# Altium schematic sheet Dent_Sheet_ESP.SchDoc (part 1 of 3)
size A2; SheetNumber: 1; SheetTotal: 1
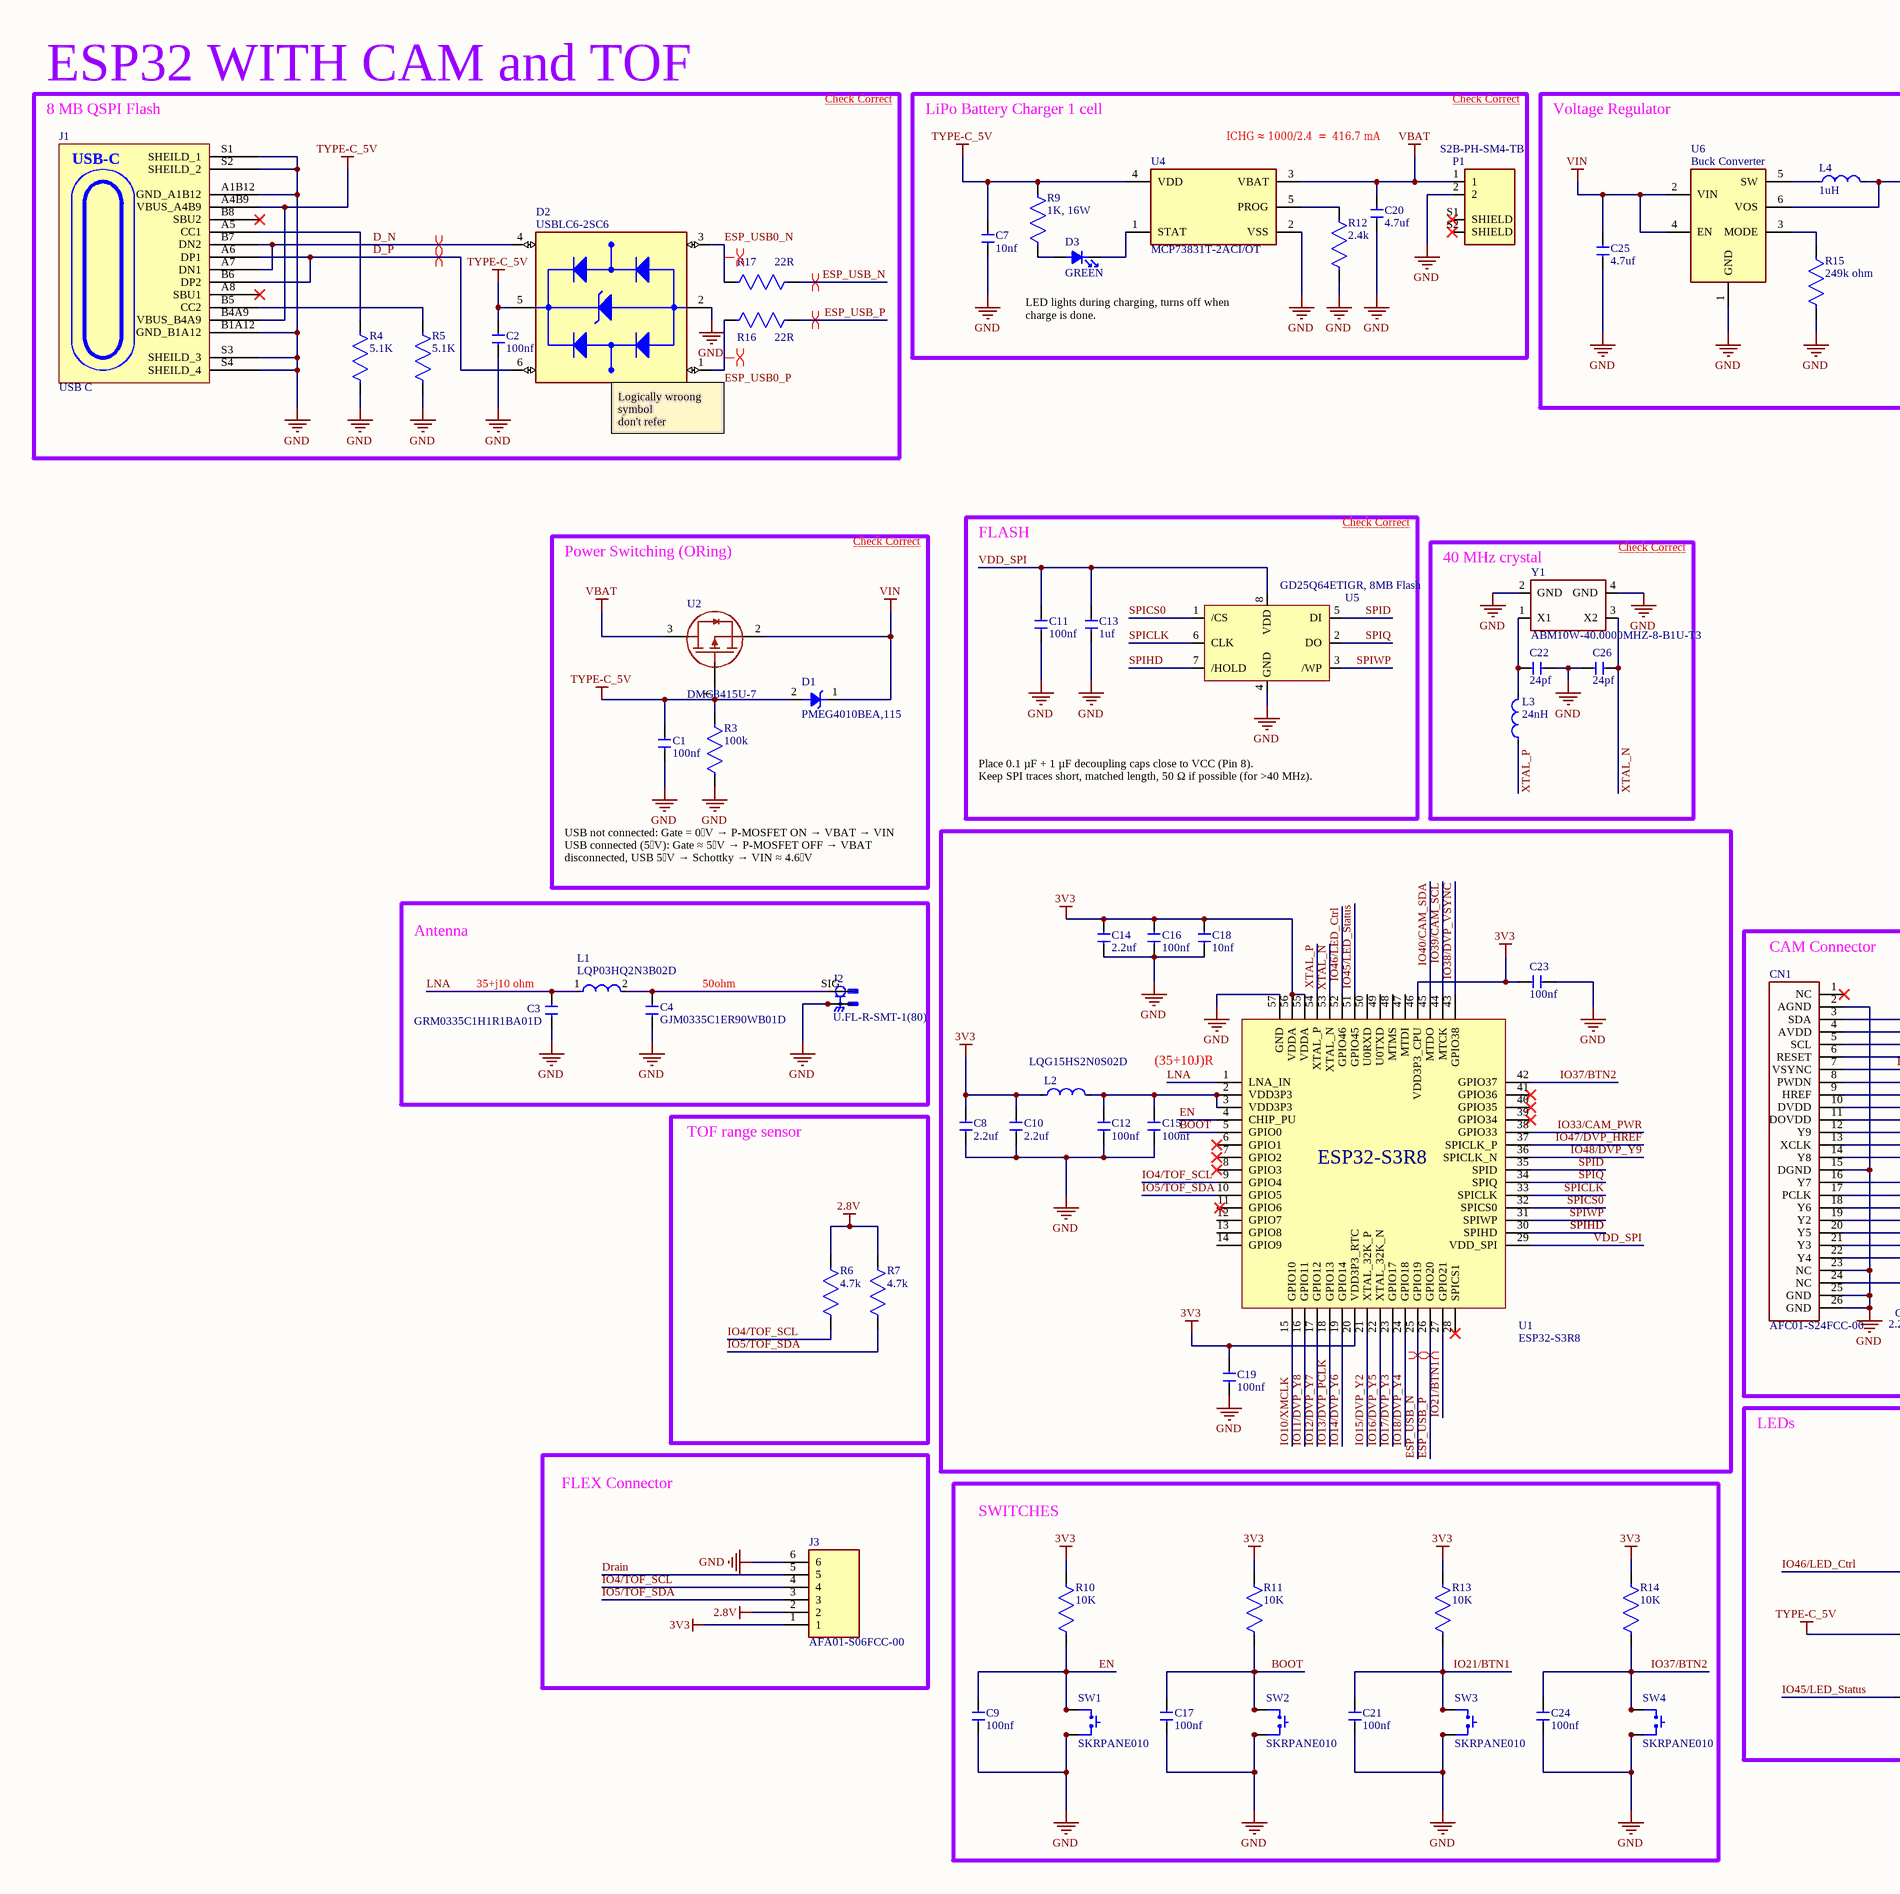
[diagram p0: Dent_Sheet_ESP.SchDoc, left]
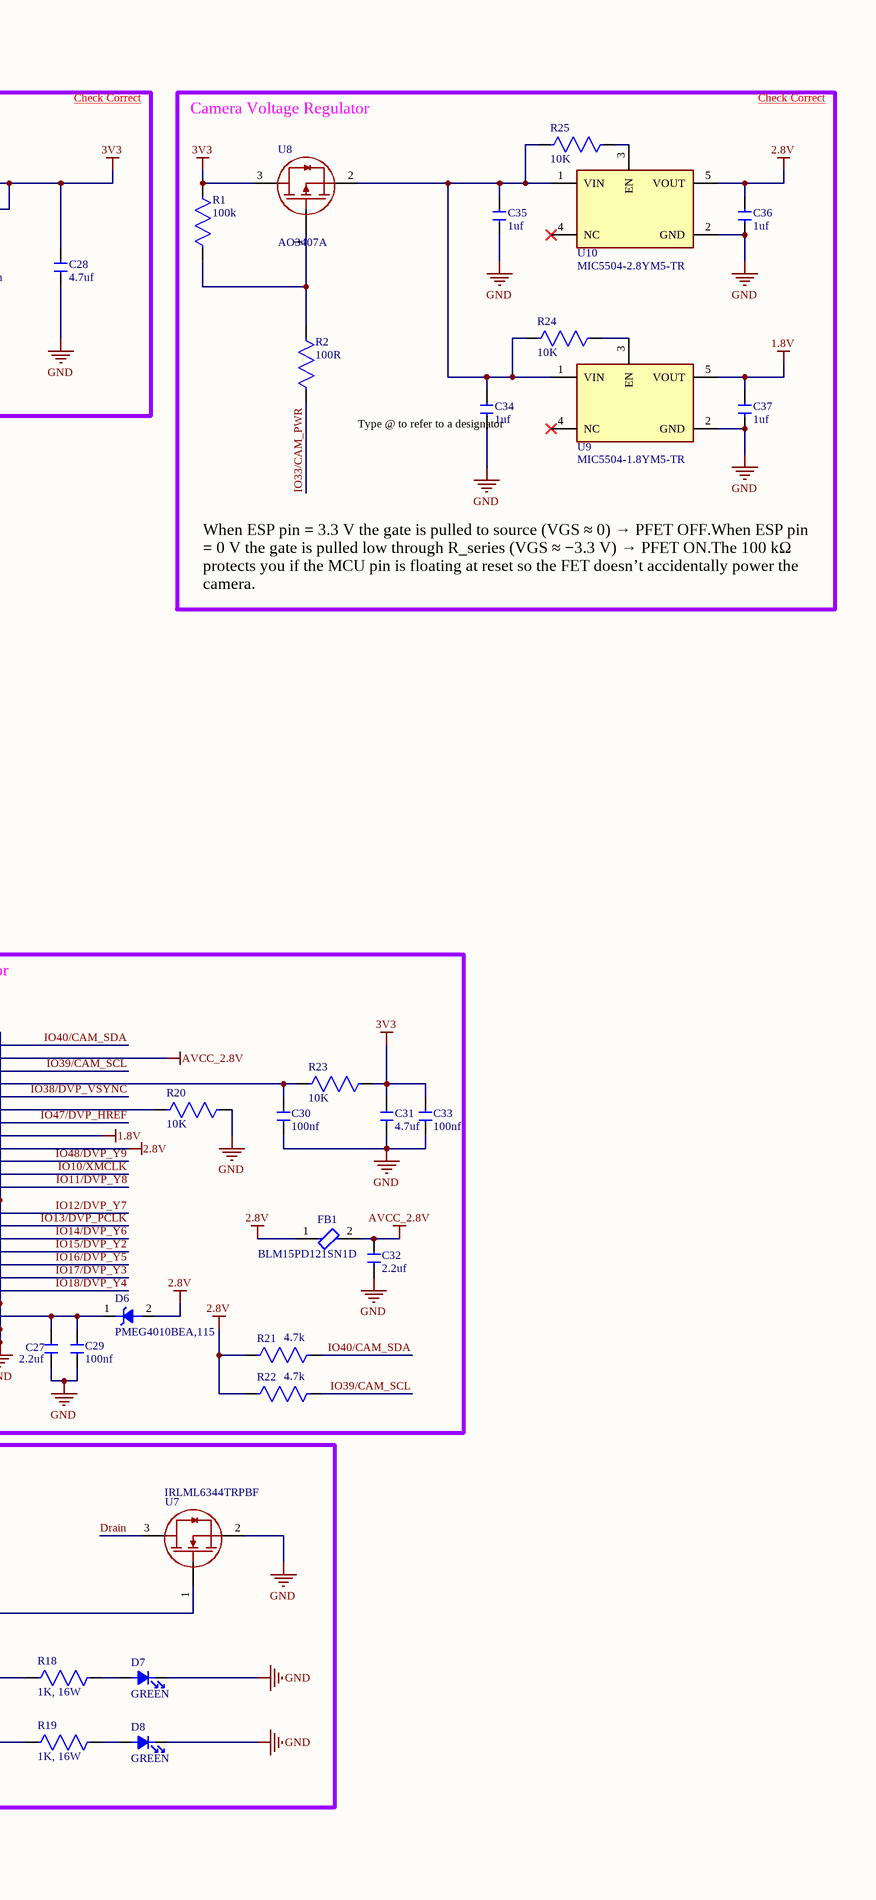
[diagram p1: Dent_Sheet_ESP.SchDoc, right]

## Parts
C1  100nf  [CAPC1005X55N]
C2  100nf  [CAPC1005X55N]
C3  GRM0335C1H1R1BA01D  [FP-GRM033-0_03-MFG]
C4  GJM0335C1ER90WB01D  [FP-GJM033-0_03-MFG]
C7  10nf  [CAPC1005X55N]
C8  2.2uf  [CAPC1005X55N]
C9  100nf  [CAPC1005X55N]
C10  2.2uf  [CAPC1005X55N]
C11  100nf  [CAPC1005X55N]
C12  100nf  [CAPC1005X55N]
C13  1uf  [CAPC1005X55N]
C14  2.2uf  [CAPC1005X55N]
C15  100nf  [CAPC1005X55N]
C16  100nf  [CAPC1005X55N]
C17  100nf  [CAPC1005X55N]
C18  10nf  [CAPC1005X55N]
C19  100nf  [CAPC1005X55N]
C20  4.7uf  [CAPC1005X55N]
C21  100nf  [CAPC1005X55N]
C22  24pf  [CAPC1005X55N]
C23  100nf  [CAPC1005X55N]
C24  100nf  [CAPC1005X55N]
C25  4.7uf  [CAPC1005X55N]
C26  24pf  [CAPC1005X55N]
C27  2.2uf  [CAPC1005X55N]
C28  4.7uf  [CAPC1005X55N]
C29  100nf  [CAPC1005X55N]
C30  100nf  [CAPC1005X55N]
C31  4.7uf  [CAPC1005X55N]
C32  2.2uf  [CAPC1005X55N]
C33  100nf  [CAPC1005X55N]
C34  1uf  [CAPC1005X55N]
C35  1uf  [CAPC1005X55N]
C36  1uf  [CAPC1005X55N]
C37  1uf  [CAPC1005X55N]
CN1  AFC01-S24FCC-00  [FH52-24S-0.5SH]
D1  PMEG4010BEA,115  [SOD2512X110N]
D2  USBLC6-2SC6  [SOT95P280X145-6N]
D3  GREEN  [LEDC1005X35N]
D6  PMEG4010BEA,115  [SOD2512X110N]
D7  GREEN  [LEDC1005X35N]
D8  GREEN  [LEDC1005X35N]
FB1  BLM15PD121SN1D  [FP-BLM15-0_05-IPC_B]
J1  USB C  [FP-2171790001-MFG]
J2  U.FL-R-SMT-1(80)  [HIROSE_U.FL-R-SMT-1(80)]
J3  AFA01-S06FCC-00  [JUSHUO_AFA01-S06FCC-00]
L1  LQP03HQ2N3B02D  [FP-LQP02HV_02-MFG]
L2  LQG15HS2N0S02D  [INDC1005X55N]
L3  24nH  [INDC1005X60N]
L4  1uH  [INDC2016X100N]
P1  S2B-PH-SM4-TB  [JST_S2B-PH-SM4-TB(LF)(SN)]
R1  100k  [RESC1005X40N]
R2  100R  [RESC1005X40N]
R3  100k  [RESC1005X40N]
R4  5.1K  [RESC1005X40N]
R5  5.1K  [RESC1005X40N]
R6  4.7k  [RESC1005X40N]
R7  4.7k  [RESC1005X40N]
R9  1K, 16W  [RESC1005X40N]
R10  10K  [RESC1005X40N]
R11  10K  [RESC1005X40N]
R12  2.4k  [RESC1005X40N]
R13  10K  [RESC1005X40N]
R14  10K  [RESC1005X40N]
R15  249k ohm  [RESC1005X40N]
R16  22R  [RESC1005X40N]
R17  22R  [RESC1005X40N]
R18  1K, 16W  [RESC1005X40N]
R19  1K, 16W  [RESC1005X40N]
R20  10K  [RESC1005X40N]
R21  4.7k  [RESC1005X40N]
R22  4.7k  [RESC1005X40N]
R23  10K  [RESC1005X40N]
R24  10K  [RESC1005X40N]
R25  10K  [RESC1005X40N]
SW1  SKRPANE010  [SKRPANE010]
SW2  SKRPANE010  [SKRPANE010]
SW3  SKRPANE010  [SKRPANE010]
SW4  SKRPANE010  [SKRPANE010]
U1  ESP32-S3R8  [FP-ESP32-S3R8-IPC_B]
U2  DMG3415U-7  [SOT95P240X105-3N]
U4  MCP73831T-2ACI/OT  [FP-C04-091-OT-IPC_A]
U5  GD25Q64ETIGR, 8MB Flash  [SOIC127P600X175-8N]
U6  Buck Converter  [SOT-563]
U7  IRLML6344TRPBF  [TRANS_IRLML6344TRPBF]
U8  AO3407A  [SOT-23-3L_AOS]
U9  MIC5504-1.8YM5-TR  [FP-SOT23-5LD-PL-1-IPC_C]
U10  MIC5504-2.8YM5-TR  [FP-SOT23-5LD-PL-1-IPC_C]
Y1  ABM10W-40.0000MHZ-8-B1U-T3  [XTAL_ABM10W-40.0000MHZ-8-B1U-T3]

## Blocks framed on the sheet
ESP32 WITH CAM and TOF: C2 D2 J1 R4 R5 R16 R17
LiPo Battery Charger 1 cell: C7 C20 D3 P1 R9 R12 U4
Voltage Regulator: C25 C28 L4 R15 U6
Camera Voltage Regulator: C34-C37 R1 R2 R24 R25 U8-U10
FLASH: C11 C13 U5
Power Switching (ORing): C1 D1 R3 U2
40 MHz crystal: C22 C26 L3 Y1
(35+10J)R: C8 C10 C12 C14-C16 C18 C19 C23 L2 U1
Antenna: C3 C4 J2 L1
CAM Connector: C27 C29-C33 CN1 D6 FB1 R20-R23
TOF range sensor: R6 R7
LEDs: D7 D8 R18 R19 U7
FLEX Connector: J3
SWITCHES: C9 C17 C21 C24 R10 R11 R13 R14 SW1-SW4

## Nets
1.8V: C37.2 CN1.10(DVDD) U9.5(VOUT)
2.8V: C36.2 CN1.11(DOVDD) D6.2 FB1.1 J3.2 R6.2 R7.2 R21.1 R22.1 U10.5(VOUT)
3V3: C8.2 C10.2 C14.2 C16.2 C18.2 C19.2 C23.2 C28.2 C31.2 C33.2 J3.1 L2.1 L4.2 R1.1 R10.2 R11.2 R13.2 R14.2 R23.1 U1.20(VDD3P3_RTC) U1.46(VDD3P3_CPU) U1.55(VDDA) U1.56(VDDA) U6.6(VOS) U8.3
AVCC_2.8V: C32.2 CN1.4(AVDD) FB1.2
GND: C1.1 C2.1 C3.1 C4.1 C7.1 C8.1 C9.1 C10.1 C11.1 C12.1 C13.1 C14.1 C15.1 C16.1 C17.1 C18.1 C19.1 C20.1 C21.1 C22.2 C23.1 C24.1 C25.1 C26.1 C27.1 C28.1 C29.1 C30.1 C31.1 C32.1 C33.1 C34.1 C35.1 C36.1 C37.1 CN1.2(AGND) CN1.15(DGND) CN1.23(NC) CN1.25(GND) CN1.26(GND) D2.2(GND) D7.1 D8.1 J1.A1B12(GND_A1B12) J1.B1A12(GND_B1A12) J1.S1(SHEILD_1) J1.S2(SHEILD_2) J1.S3(SHEILD_3) J1.S4(SHEILD_4) J2.G1(GND) J2.G2(GND) J3.6 P1.2 R3.1 R4.2 R5.2 R12.1 R15.1 R20.1 SW1.1 SW1.2 SW2.1 SW2.2 SW3.1 SW3.2 SW4.1 SW4.2 U1.57(GND) U4.2(VSS) U5.4(GND) U6.1(GND) U7.2 U9.2(GND) U10.2(GND) Y1.2(GND) Y1.4(GND)
TYPE-C_5V: C1.2 C2.2 C7.2 D1.2 D2.5(VBUS) J1.A4B9(VBUS_A4B9) J1.B4A9(VBUS_B4A9) R3.2 R9.2 R18.2 U2.1 U4.4(VDD)
VBAT: C20.2 P1.1 U2.3 U4.3(VBAT)
VIN: C25.2 D1.1 U2.2 U6.2(VIN) U6.4(EN)
BOOT: C17.2 R11.1 SW2.3 SW2.4 U1.5(GPIO0)
D_N: D2.4(I/O2_OUT) J1.A7(DN1) J1.B7(DN2)
D_P: D2.6(I/O1_OUT) J1.A6(DP1) J1.B6(DP2)
Drain: J3.5 U7.3
EN: C9.2 R10.1 SW1.3 SW1.4 U1.4(CHIP_PU)
ESP_USB0_N: D2.3(I/O2_IN) R17.1
ESP_USB0_P: D2.1(I/O1_IN) R16.1
ESP_USB_N: R17.2 U1.25(GPIO19)
ESP_USB_P: R16.2 U1.26(GPIO20)
IO4/TOF_SCL: J3.4 R6.1 U1.9(GPIO4)
IO5/TOF_SDA: J3.3 R7.1 U1.10(GPIO5)
IO10/XMCLK: CN1.13(XCLK) U1.15(GPIO10)
IO11/DVP_Y8: CN1.14(Y8) U1.16(GPIO11)
IO12/DVP_Y7: CN1.16(Y7) U1.17(GPIO12)
IO13/DVP_PCLK: CN1.17(PCLK) U1.18(GPIO13)
IO14/DVP_Y6: CN1.18(Y6) U1.19(GPIO14)
IO15/DVP_Y2: CN1.19(Y2) U1.21(XTAL_32K_P)
IO16/DVP_Y5: CN1.20(Y5) U1.22(XTAL_32K_N)
IO17/DVP_Y3: CN1.21(Y3) U1.23(GPIO17)
IO18/DVP_Y4: CN1.22(Y4) U1.24(GPIO18)
IO21/BTN1: C21.2 R13.1 SW3.3 SW3.4 U1.27(GPIO21)
IO33/CAM_PWR: R2.1 U1.38(GPIO33)
IO37/BTN2: C24.2 R14.1 SW4.3 SW4.4 U1.42(GPIO37)
IO38/DVP_VSYNC: CN1.7(VSYNC) U1.43(GPIO38)
IO39/CAM_SCL: CN1.5(SCL) R22.2 U1.44(MTCK)
IO40/CAM_SDA: CN1.3(SDA) R21.2 U1.45(MTDO)
IO45/LED_Status: R19.2 U1.51(GPIO45)
IO46/LED_Ctrl: U1.52(GPIO46) U7.1
IO47/DVP_HREF: CN1.9(HREF) U1.37(SPICLK_P)
IO48/DVP_Y9: CN1.12(Y9) U1.36(SPICLK_N)
LNA: C3.2 L1.1 U1.1(LNA_IN)
SPICLK: U1.33(SPICLK) U5.6(CLK)
SPICS0: U1.32(SPICS0) U5.1(/CS)
SPID: U1.35(SPID) U5.5(DI)
SPIHD: U1.30(SPIHD) U5.7(/HOLD)
SPIQ: U1.34(SPIQ) U5.2(DO)
SPIWP: U1.31(SPIWP) U5.3(/WP)
VDD_SPI: C11.2 C13.2 U1.29(VDD_SPI) U5.8(VDD)
XTAL_N: C26.2 U1.53(XTAL_N) Y1.3(X2)
XTAL_P: L3.1 U1.54(XTAL_P)
NetC4_2: C4.2 J2.SIG L1.2
NetC12_2: C12.2 C15.2 L2.2 U1.2(VDD3P3) U1.3(VDD3P3)
NetC22_1: C22.1 L3.2 Y1.1(X1)
NetC27_2: C27.2 C29.2 CN1.24(NC) D6.1
NetC30_2: C30.2 CN1.6(RESET) R23.2
NetC34_2: C34.2 C35.2 R24.1 R25.1 U8.2 U9.1(VIN) U10.1(VIN)
NetCN1_8: CN1.8(PWDN) R20.2
NetD3_1: D3.1 U4.1(STAT)
NetD3_2: D3.2 R9.1
NetD7_2: D7.2 R18.1
NetD8_2: D8.2 R19.1
NetJ1_A5: J1.A5(CC1) R4.1
NetJ1_B5: J1.B5(CC2) R5.1
NetL4_1: L4.1 U6.5(SW)
NetR1_2: R1.2 R2.2 U8.1
NetR12_2: R12.2 U4.5(PROG)
NetR15_2: R15.2 U6.3(MODE)
NetR24_2: R24.2 U9.3(EN)
NetR25_2: R25.2 U10.3(EN)

Not connected (* = marked no-connect by the designer): CN1 1(NC)*; J1 A8(SBU1)* B8(SBU2)*; P1 S1(SHIELD)* S2(SHIELD)*; U1 6(GPIO1)* 7(GPIO2)* 8(GPIO3)* 11(GPIO6) 12(GPIO7) 13(GPIO8) 14(GPIO9) 28(SPICS1)* 39(GPIO34)* 40(GPIO35)* 41(GPIO36)* 47(MTDI) 48(MTMS) 49(U0TXD) 50(U0RXD); U9 4(NC)*; U10 4(NC)*

## Layout directives
differential pair; differential pair class DIFF90: D_N, D_P, ESP_USB0_N, ESP_USB0_P, ESP_USB_N, ESP_USB_P

## Notes on the sheet
- Check Correct
- 8 MB QSPI Flash
- (near U4) ICHG​ ≈ 1000/2.4 ​ =  416.7 mA
- LED lights during charging, turns off when charge is done.
- (near D2) Logically wroong symbol
  don't refer
- Type @ to refer to a designator
- (near Y1) Check Correct
- When ESP pin = 3.3 V the gate is pulled to source (VGS ≈ 0) → PFET OFF.When ESP pin = 0 V the gate is pulled low through R_series (VGS ≈ −3.3 V) → PFET ON.The 100 kΩ protects you if the MCU pin is floating at reset so the FET doesn’t accidentally power the camera.
- Place 0.1 µF + 1 µF decoupling caps close to VCC (Pin 8).
  Keep SPI traces short, matched length, 50 Ω if possible (for >40 MHz).
- USB not connected: Gate = 0 V → P-MOSFET ON → VBAT → VIN
  USB connected (5 V): Gate ≈ 5 V → P-MOSFET OFF → VBAT disconnected, USB 5 V → Schottky → VIN ≈ 4.6 V
- (near C3) 35+j10 ohm
- 50ohm
- (in symbol 217179-0001) USB-C